# EasyEDA Pro project 嘉立创工程文件.epro

# Board PCB1
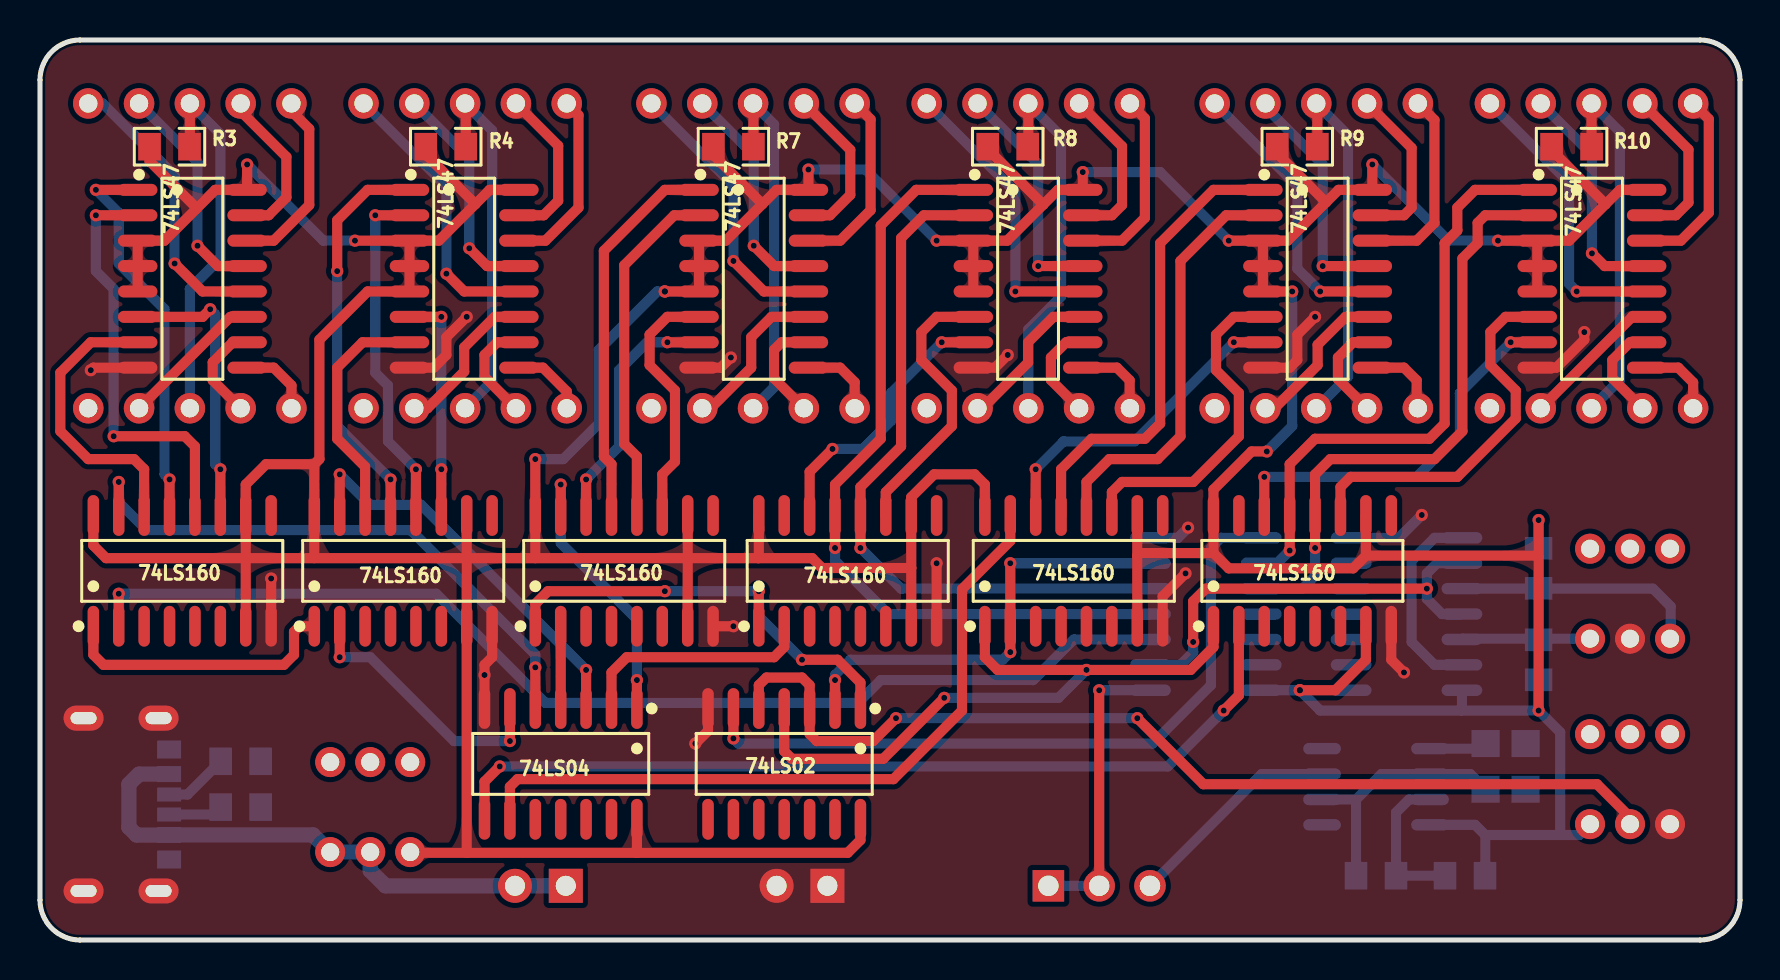
[diagram p0: board, top side]
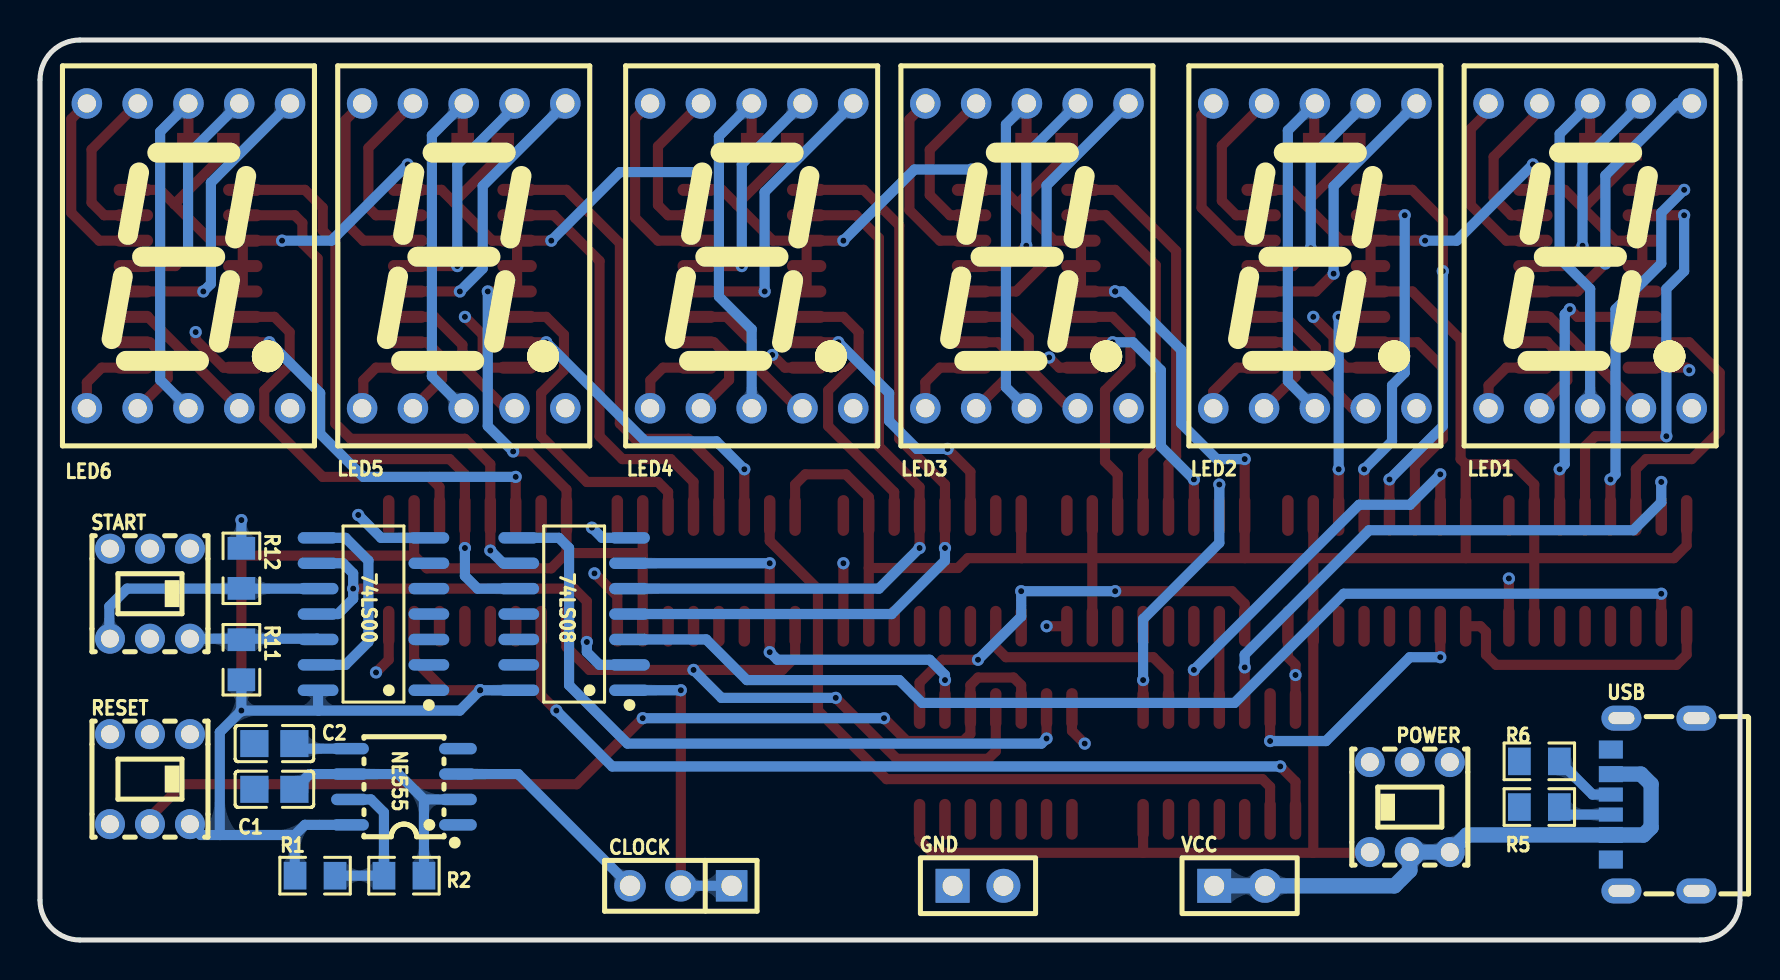
[diagram p1: board, bottom side, seen from below]

Outline 85 x 45 mm; copper layers: Top Layer, Bottom Layer. Coordinates in mm from the lower left corner of the outline.
Outline path: 0,43 0,2 arc(0.59,0.59) 2,0 83,0 arc(84.41,0.59) 85,2 85,43 arc(84.41,44.41) 83,45 2,45 arc(0.59,44.41) 0,43
Stack: Top Layer 0.035mm / Dielectric1 1.51mm FR4 er 4.5 / Bottom Layer 0.035mm

## Design rules (mm)
template: 自定义配置
spacing copperThickness1oz (default): track to track 0.102, other pairs 0.152 to 0.3
spacing copperThickness2oz: track to track 0.203, other pairs 0.152 to 0.3
track width copperThickness1oz (default): min 0.127, default 0.254, max 2.54
track width copperThickness2oz: min 0.203, default 0.254, max 2.54
differential pair differentialPair (default): width min 0.127, default 0.254, max 2.54; gap min 0.152, default 0.152
via viaSize (default): diameter min 0.5, default 0.61, max 10; hole min 0.3, default 0.305, max 6.3
net GND uses copperRegion1

## Placement (name value [footprint] x y rotation side)
74LS00  SN74LS00DR  [SOIC-14_L8.7-W3.9-P1.27-LS6.0-BL]  68.33 16.3 90 bottom
74LS02  SN74LS02DR  [SOIC-14_L8.7-W3.9-P1.27-LS6.0-BL]  37.21 8.81 180 top
74LS04  SN74LS04DR  [SOIC-14_L8.7-W3.9-P1.27-LS6.0-BL]  26.03 8.81 180 top
74LS08  SN74LS08DR  [SOIC-14_L8.7-W3.9-P1.27-LS6.0-BL]  58.29 16.3 90 bottom
74LS47  -  [SOIC-16_L9.9-W3.9-P1.27-LS6.0-BL]  21.21 33.06 270 top
74LS47#2  -  [SOIC-16_L9.9-W3.9-P1.27-LS6.0-BL]  7.62 33.06 270 top
74LS47#3  -  [SOIC-16_L9.9-W3.9-P1.27-LS6.0-BL]  35.69 33.06 270 top
74LS47#4  -  [SOIC-16_L9.9-W3.9-P1.27-LS6.0-BL]  49.4 33.06 270 top
74LS47#5  -  [SOIC-16_L9.9-W3.9-P1.27-LS6.0-BL]  63.88 33.06 270 top
74LS47#6  -  [SOIC-16_L9.9-W3.9-P1.27-LS6.0-BL]  77.6 33.06 270 top
74LS160  -  [SOP-16_L9.9-W3.9-P1.27-LS6.0-BL]  7.11 18.46 0 top
74LS160#2  -  [SOP-16_L9.9-W3.9-P1.27-LS6.0-BL]  18.16 18.46 0 top
74LS160#3  -  [SOP-16_L9.9-W3.9-P1.27-LS6.0-BL]  29.21 18.46 0 top
74LS160#4  -  [SOP-16_L9.9-W3.9-P1.27-LS6.0-BL]  40.39 18.46 0 top
74LS160#5  -  [SOP-16_L9.9-W3.9-P1.27-LS6.0-BL]  51.69 18.46 0 top
74LS160#6  -  [SOP-16_L9.9-W3.9-P1.27-LS6.0-BL]  63.12 18.46 0 top
C1  1uF  [C0805]  73.28 7.53 180 bottom
C2  10nF  [C0805]  73.28 9.82 0 bottom
CLOCK  -  [HDR-TH_3P-P2.54-V-F]  52.96 2.71 0 bottom
GND  -  [HDR-TH_2P-P2.54-V-F]  38.1 2.71 180 bottom
LED1  -  [LED-SEG-TH_10P-L12.6-W19.0-P2.54-S15.24-BL]  7.49 34.21 180 bottom
LED2  -  [LED-SEG-TH_10P-L12.6-W19.0-P2.54-S15.24-BL]  21.26 34.21 180 bottom
LED3  -  [LED-SEG-TH_10P-L12.6-W19.0-P2.54-S15.24-BL]  35.65 34.21 180 bottom
LED4  -  [LED-SEG-TH_10P-L12.6-W19.0-P2.54-S15.24-BL]  49.42 34.21 180 bottom
LED5  -  [LED-SEG-TH_10P-L12.6-W19.0-P2.54-S15.24-BL]  63.81 34.21 180 bottom
LED6  -  [LED-SEG-TH_10P-L12.6-W19.0-P2.54-S15.24-BL]  77.58 34.21 180 bottom
NE555  NE555PSRG4  [SO-8_L4.9-W3.9-P1.27-LS5.9-BL]  66.8 7.66 90 bottom
POWER  XKB5858-Z  [SW-TH_6P-L5.8-W5.8-P2.00-LS4.5-BL]  16.51 6.65 0 bottom
R1  10K  [R0805]  71.25 3.22 180 bottom
R2  2.2K  [R0805]  66.8 3.22 0 bottom
R3  750  [R0805]  6.48 39.67 180 top
R4  750  [R0805]  20.29 39.67 180 top
R5  5.1K  [R0805]  10.03 6.65 0 bottom
R6  5.1K  [R0805]  10.03 8.93 0 bottom
R7  750  [R0805]  34.67 39.67 180 top
R8  750  [R0805]  48.39 39.67 180 top
R9  750  [R0805]  62.87 39.67 180 top
R10  750  [R0805]  76.58 39.67 180 top
R11  10K  [R0805]  74.93 14.01 270 bottom
R12  10K  [R0805]  74.93 18.58 270 bottom
RESET  XKB5858-Z  [SW-TH_6P-L5.8-W5.8-P2.00-LS4.5-BL]  79.5 8.04 180 bottom
START  XKB5858-Z  [SW-TH_6P-L5.8-W5.8-P2.00-LS4.5-BL]  79.5 17.31 180 bottom
USB  -  [USB_ TYPE-C-6P]  4.32 6.65 90 bottom
VCC  -  [HDR-TH_2P-P2.54-V-F]  25.02 2.71 180 bottom

## Footprints (pads in the part's own frame, mm; a bottom-side part is the same pattern mirrored in y, then rotated)
C0805
  rect 1.41x1.35 smd: 1(-1,0) 2(1,0)
HDR-TH_2P-P2.54-V-F
  rect 1.7x1.7 hole 1: 1(-1.27,0)
  round 1.7 hole 1: 2(1.27,0)
HDR-TH_3P-P2.54-V-F
  rect 1.575x1.575 hole 1.02: 1(-2.54,0)
  round 1.575 hole 1.02: 2(0,0) 3(2.54,0)
LED-SEG-TH_10P-L12.6-W19.0-P2.54-S15.24-BL
  round 1.524 hole 0.914: 1(-5.08,-7.62) 2(-2.54,-7.62) 3(0,-7.62) 4(2.54,-7.62) 5(5.08,-7.62) 6(5.08,7.62) 7(2.54,7.62) 8(0,7.62) 9(-2.54,7.62) 10(-5.08,7.62)
R0805
  rect 1.133x1.377 smd: 1(-1,0) 2(1,0)
SO-8_L4.9-W3.9-P1.27-LS5.9-BL
  oval 0.574x1.888 smd: 1(-1.905,-2.699) 2(-0.635,-2.699) 3(0.635,-2.699) 4(1.905,-2.699) 5(1.905,2.699) 6(0.635,2.699) 7(-0.635,2.699) 8(-1.905,2.699)
SOIC-14_L8.7-W3.9-P1.27-LS6.0-BL
  oval 0.574x2.038 smd: 1(-3.81,-2.769) 2(-2.54,-2.769) 3(-1.27,-2.769) 4(0,-2.769) 5(1.27,-2.769) 6(2.54,-2.769) 7(3.81,-2.769) 8(3.81,2.769) 9(2.54,2.769) 10(1.27,2.769) 11(0,2.769) 12(-1.27,2.769) 13(-2.54,2.769) 14(-3.81,2.769)
SOIC-16_L9.9-W3.9-P1.27-LS6.0-BL
  oval 0.602x1.971 smd: 1(-4.445,-2.736) 2(-3.175,-2.736) 3(-1.905,-2.736) 4(-0.635,-2.736) 5(0.635,-2.736) 6(1.905,-2.736) 7(3.175,-2.736) 8(4.445,-2.736) 9(4.445,2.736) 10(3.175,2.736) 11(1.905,2.736) 12(0.635,2.736) 13(-0.635,2.736) 14(-1.905,2.736) 15(-3.175,2.736) 16(-4.445,2.736)
SOP-16_L9.9-W3.9-P1.27-LS6.0-BL
  oval 0.574x2.038 smd: 1(-4.445,-2.769) 2(-3.175,-2.769) 3(-1.905,-2.769) 4(-0.635,-2.769) 5(0.635,-2.769) 6(1.905,-2.769) 7(3.175,-2.769) 8(4.445,-2.769) 9(4.445,2.769) 10(3.175,2.769) 11(1.905,2.769) 12(0.635,2.769) 13(-0.635,2.769) 14(-1.905,2.769) 15(-3.175,2.769) 16(-4.445,2.769)
SW-TH_6P-L5.8-W5.8-P2.00-LS4.5-BL
  round 1.5 hole 0.9: 1(-2,-2.25) 2(0,-2.25) 3(2,-2.25) 4(-2,2.25) 5(0,2.25) 6(2,2.25)
USB_ TYPE-C-6P
  oval 1.25x2 hole 0.6x1.3: 7(-4.193,1.611) 8(4.447,1.611) 9(-4.193,-2.139) 10(4.447,-2.139)
  rect 0.7x1.2 smd: A5(-0.373,2.139) B5(0.627,2.139)
  rect 0.8x1.2 smd: A9(1.647,2.139) B9(-1.393,2.139)
  rect 0.9x1.2 smd: A12(2.877,2.139) B12(-2.623,2.139)

## Nets
GND: 74LS00.7 74LS02.7 74LS04.7 74LS08.7 74LS47.8 74LS47#2.8 74LS47#3.8 74LS47#4.8 74LS47#5.8 74LS47#6.8 74LS160.8 74LS160#2.8 74LS160#3.8 74LS160#4.8 74LS160#5.8 74LS160#6.8 C1.1 C2.2 GND.1 GND.2 NE555.1 NE555.4 R5.2 R6.2 RESET.1 START.2 USB.7 USB.8 USB.9 USB.10 USB.A12 USB.B12
VCC: 74LS00.14 74LS02.14 74LS04.14 74LS08.14 74LS47.3 74LS47.4 74LS47.5 74LS47.16 74LS47#2.3 74LS47#2.4 74LS47#2.5 74LS47#2.16 74LS47#3.3 74LS47#3.4 74LS47#3.5 74LS47#3.16 74LS47#4.3 74LS47#4.4 74LS47#4.5 74LS47#4.16 74LS47#5.3 74LS47#5.4 74LS47#5.5 74LS47#5.16 74LS47#6.3 74LS47#6.4 74LS47#6.5 74LS47#6.16 74LS160.7 74LS160.10 74LS160.16 74LS160#2.7 74LS160#2.10 74LS160#2.16 74LS160#3.7 74LS160#3.10 74LS160#3.16 74LS160#4.7 74LS160#4.10 74LS160#4.16 74LS160#5.7 74LS160#5.10 74LS160#5.16 74LS160#6.7 74LS160#6.10 74LS160#6.16 NE555.8 POWER.6 R1.1 R3.2 R4.2 R7.2 R8.2 R9.2 R10.2 R11.2 R12.1 RESET.3
$1N999: 74LS47#2.13 LED1.7
$1N1001: 74LS47#2.12 LED1.6
$1N1003: 74LS47#2.11 LED1.4
$1N1005: 74LS47#2.10 LED1.2
$1N1007: 74LS47#2.9 LED1.1
$1N1023: 74LS47#2.14 LED1.10
$1N1028: 74LS47#2.15 LED1.9
$1N1089: LED1.3 LED1.8 R3.1
$1N1147: 74LS47#2.1 74LS160.13
$1N1150: 74LS47#2.2 74LS160.12
$1N1153: 74LS47#2.6 74LS160.11
$1N1161: 74LS47#2.7 74LS160.14
$1N1913: NE555.7 R1.2 R2.2
$1N1926: C1.2 NE555.2 NE555.6 R2.1
$1N2122: C2.1 NE555.5
$1N2566: 74LS08.1 CLOCK.1 CLOCK.2
$1N2570: CLOCK.3 NE555.3
$1N2724: 74LS08.3 74LS160.2
$1N3048: 74LS47.11 LED2.4
$1N3050: 74LS47.10 LED2.2
$1N3052: 74LS47.9 LED2.1
$1N3054: 74LS47.12 LED2.6
$1N3056: 74LS47.13 LED2.7
$1N3058: 74LS47.14 LED2.10
$1N3062: 74LS47.15 LED2.9
$1N3066: LED2.3 LED2.8 R4.1
$1N3073: 74LS47.1 74LS160#2.13
$1N3075: 74LS47.2 74LS160#2.12
$1N3077: 74LS47.6 74LS160#2.11
$1N3081: 74LS47.7 74LS160#2.14
$1N3329: 74LS160.1 74LS160#2.1
$1N3374: R5.1 USB.A5
$1N3426: R6.1 USB.B5
$1N3994: 74LS47#3.11 LED3.4
$1N3996: 74LS47#3.10 LED3.2
$1N3998: 74LS47#3.9 LED3.1
$1N4000: 74LS47#3.12 LED3.6
$1N4002: 74LS47#3.13 LED3.7
$1N4004: 74LS47#3.14 LED3.10
$1N4008: 74LS47#3.15 LED3.9
$1N4012: LED3.3 LED3.8 R7.1
$1N4019: 74LS47#3.1 74LS160#3.13
$1N4021: 74LS47#3.2 74LS160#3.12
$1N4023: 74LS47#3.6 74LS160#3.11
$1N4027: 74LS47#3.7 74LS160#3.14
$1N4390: 74LS04.3 74LS160#2.15
$1N4396: 74LS04.4 74LS160#3.2
$1N4713: 74LS47#4.11 LED4.4
$1N4715: 74LS47#4.10 LED4.2
$1N4717: 74LS47#4.9 LED4.1
$1N4719: 74LS47#4.12 LED4.6
$1N4721: 74LS47#4.13 LED4.7
$1N4723: 74LS47#4.14 LED4.10
$1N4727: 74LS47#4.15 LED4.9
$1N4731: LED4.3 LED4.8 R8.1
$1N4742: 74LS47#4.6 74LS160#4.11
$1N4746: 74LS47#4.7 74LS160#4.14
$1N4816: 74LS08.4 74LS47#4.1 74LS160#4.13
$1N4845: 74LS08.5 74LS47#4.2 74LS160#4.12
$1N5159: 74LS02.1 74LS160#3.1 74LS160#4.1
$1N6867: 74LS47#5.11 LED5.4
$1N6869: 74LS47#5.10 LED5.2
$1N6871: 74LS47#5.9 LED5.1
$1N6873: 74LS47#5.12 LED5.6
$1N6875: 74LS47#5.13 LED5.7
$1N6877: 74LS47#5.14 LED5.10
$1N6881: 74LS47#5.15 LED5.9
$1N6885: LED5.3 LED5.8 R9.1
$1N6892: 74LS47#5.1 74LS160#5.13
$1N6894: 74LS47#5.2 74LS160#5.12
$1N6896: 74LS47#5.6 74LS160#5.11
$1N6900: 74LS47#5.7 74LS160#5.14
$1N6917: 74LS47#6.11 LED6.4
$1N6919: 74LS47#6.10 LED6.2
$1N6921: 74LS47#6.9 LED6.1
$1N6923: 74LS47#6.12 LED6.6
$1N6925: 74LS47#6.13 LED6.7
$1N6927: 74LS47#6.14 LED6.10
$1N6931: 74LS47#6.15 LED6.9
$1N6935: LED6.3 LED6.8 R10.1
$1N6942: 74LS47#6.6 74LS160#6.11
$1N6946: 74LS47#6.7 74LS160#6.14
$1N6998: 74LS02.3 74LS02.5 RESET.2
$1N7178: 74LS02.2 74LS08.6 74LS160#5.2
$1N7221: 74LS08.9 74LS47#6.1 74LS160#6.13
$1N7284: 74LS08.10 74LS47#6.2 74LS160#6.12
$1N7463: 74LS04.9 74LS160#5.15
$1N7493: 74LS02.6 74LS08.8
$1N7514: 74LS02.4 74LS160#5.1 74LS160#6.1
$1N7599: 74LS04.8 74LS160#6.2
$1N9167: 74LS04.1 74LS160#3.15
$1N9178: 74LS04.2 74LS160#4.2
$1N9189: 74LS04.5 74LS160.15
$1N9202: 74LS04.6 74LS160#2.2
$1N9229: 74LS00.12 R11.1 START.3
$1N9276: 74LS00.10 R12.2 START.1
$1N9292: 74LS00.9 74LS00.11 74LS08.2
$1N9334: 74LS00.8 74LS00.13
$1N9513: POWER.4 POWER.5 USB.A9 USB.B9 VCC.1 VCC.2

Pads without a net: 74LS00 1 2 3 4 5 6; 74LS02 8 9 10 11 12 13; 74LS04 10 11 12 13; 74LS08 11 12 13; 74LS160 3 4 5 6 9; 74LS160#2 3 4 5 6 9; 74LS160#3 3 4 5 6 9; 74LS160#4 3 4 5 6 9 15; 74LS160#5 3 4 5 6 9; 74LS160#6 3 4 5 6 9 15; LED1 5; LED2 5; LED3 5; LED4 5; LED5 5; LED6 5; POWER 1 2 3; RESET 4 5 6; START 4 5 6

## Via types
v1: diameter 0.61, hole 0.305, Top Layer to Bottom Layer, 109 vias

## Routing (per net, layer and track width the routed paths; a pad name or vN(x,y) marks a point on that pad's centre or on a via; arc(x,y) is an arc through that point)
GND: length 43
  Top Layer w0.508: 74LS47#5.8 62.48,28.62 62.87,29 62.87,30.27 v1(63.75,31.16) ; v1(68.2,13.38) 67.56,14.01 74LS160#6.8 ; v1(32.77,9.82) 33.4,10.46 74LS02.7 ; v1(77.22,30.39) 77.22,30.01 75.82,28.62 74LS47#6.8 ; 74LS47#3.8 34.04,28.62 v1(34.54,29.12) ; v1(2.54,28.49) 2.67,28.62 74LS47#2.8 ; v1(21.34,31.16) 20.32,30.14 20.32,29.25 19.69,28.62 74LS47.8 ; 74LS160#5.8 56.13,17.19 v1(57.28,18.33) ; v1(48.39,29.25) 47.75,28.62 74LS47#4.8 ; 74LS160#4.8 v1(44.83,18.84) ; 74LS160#3.8 v1(34.67,15.69) ; 74LS160.8 v1(11.56,18.08) ; 74LS160#2.8 22.61,14.14 22.22,13.76 v1(22.22,13.25) 74LS04.7
  Bottom Layer w0.508: v1(69.09,21.25) 67.94,20.11 74LS00.7 ; 74LS08.7 56.9,20.11 v1(57.4,20.62)
VCC: length 369.1
  Top Layer w0.508: 74LS160#5.16 47.24,22.78 46.74,23.28 44.7,23.28 43.56,22.14 74LS160#4.10 43.56,18.6 ; v1(62.99,12.49) 64.77,12.49 66.29,14.01 74LS160#6.7 ; v1(62.61,32.43) 61.15,32.43 74LS47#5.4 74LS47#5.3 ; 10.29,19.09 21.34,19.09 ; 10.29,19.09 10.29,15.69 ; 10.29,19.09 10.29,22.78 11.3,23.79 13.72,23.79 ; 10.29,19.09 3.3,19.09 2.67,19.73 74LS160.16 ; 21.34,19.09 74LS160#2.7 21.34,4.38 21.35,4.36 ; 21.34,19.09 32.38,19.09 ; 21.34,19.09 74LS160#2.10 ; 21.35,4.36 18.55,4.36 POWER.6 ; 21.35,4.36 29.84,4.36 ; R7.2 33.67,39.25 36.12,36.8 ; 74LS47.16 22.48,37.51 21.77,36.8 ; 4.88,32.43 74LS47#2.4 74LS47#2.3 6.22,34.97 7.8,36.55 ; 43.56,18.6 39.1,18.6 38.61,19.09 35.92,19.09 ; 43.56,18.6 74LS160#4.7 ; 54.86,19.21 74LS160#5.7 ; 54.86,19.21 55,19.35 58.67,19.35 ; 54.86,19.21 74LS160#5.10 ; v1(66.62,38.78) 74LS47#5.16 64.93,37.51 64.3,36.89 ; 24.76,19.09 v1(24.76,24.05) ; 58.67,19.35 74LS160#6.16 58.67,22.52 60.58,24.43 v1(61.34,24.43) ; 58.67,19.35 59.44,18.58 65.66,18.58 66.29,19.22 ; 21.77,36.8 19.29,39.28 R4.2 ; 21.77,36.8 19.94,34.97 74LS47.3 ; 74.93,19.16 v1(74.93,21) ; 74.93,19.16 v1(74.93,11.47) ; 74.93,19.16 74.87,19.22 66.29,19.22 ; 66.29,19.22 74LS160#6.10 ; 13.72,23.79 13.97,24.05 13.97,30.01 16.38,32.43 18.47,32.43 74LS47.4 74LS47.3 ; 13.72,23.79 74LS160#2.16 13.72,19.09 ; v1(31.24,32.43) 32.95,32.43 74LS47#3.4 74LS47#3.3 34.29,34.97 36.12,36.8 ; 32.38,19.09 32.38,15.69 ; 32.38,19.09 35.92,19.09 ; 32.38,19.09 32.38,21.23 ; 46.67,32.43 74LS47#4.4 74LS47#4.3 ; 36.12,36.8 36.83,37.51 74LS47#3.16 v1(38.42,38.52) ; R9.2 61.87,39.32 64.3,36.89 ; 74LS47#6.3 74LS47#6.4 74.86,32.43 ; 74LS47#6.3 v1(72.9,34.97) ; 74LS47#6.3 76.45,34.97 78.28,36.79 ; R10.2 75.58,39.49 78.28,36.79 ; 35.92,19.09 35.94,19.11 74LS160#4.16 ; 50.16,36.77 48.36,34.97 74LS47#4.3 ; 50.16,36.77 47.39,39.54 R8.2 ; 50.16,36.77 50.9,37.51 74LS47#4.16 v1(52.14,38.4) ; 7.8,36.55 8.76,37.51 74LS47#2.16 v1(10.36,38.78) ; 7.8,36.55 7.8,36.62 5.48,38.95 R3.2 ; 64.3,36.89 62.38,34.97 74LS47#5.3 ; 74LS04.14 29.84,4.36 ; 29.84,4.36 40.39,4.36 41.02,5 41.02,6.04 ; 74LS47#4.3 v1(44.83,34.97) ; 74LS47#5.3 v1(59.44,34.97) ; 74LS47.3 v1(15.75,34.97) ; 78.28,36.79 78.99,37.51 74LS47#6.16
  Bottom Layer w0.508: 76.01,5.25 72.26,5.25 ; 76.01,5.25 76.01,10.39 v1(74.93,11.47) ; 76.01,5.25 76.96,5.25 RESET.3 ; 72.26,5.25 71.75,5.76 NE555.8 ; 72.26,5.25 72.26,3.23 R1.1 ; v1(24.76,24.05) 26.16,24.05 27.94,25.82 27.94,29.51 30.86,32.43 v1(31.24,32.43) ; v1(74.93,11.47) R11.2 ; v1(74.93,11.47) 71.07,11.47 ; v1(72.9,34.97) 70.43,34.97 v1(66.62,38.78) ; 74LS08.14 v1(62.99,12.49) 64.01,11.47 71.07,11.47 ; v1(62.61,32.43) 62.61,25.7 v1(61.34,24.43) ; 71.07,11.47 71.09,11.5 74LS00.14 ; v1(59.44,34.97) 56.01,38.4 v1(52.14,38.4) ; v1(15.75,34.97) 14.17,34.97 v1(10.36,38.78) ; v1(38.42,38.52) 41.28,38.52 v1(44.83,34.97) ; R12.1 v1(74.93,21)
$1N999: length 11.2
  Top Layer w0.508: 74LS47#2.13 8.89,33.7 v1(7.87,34.71)
  Bottom Layer w0.508: LED1.7 7.87,38.91 v1(7.87,34.71)
$1N1001: length 14.4
  Top Layer w0.508: v1(6.73,33.82) 8.13,32.43 10.36,32.43
  Bottom Layer w0.508: LED1.6 3.13,41.83 6.73,38.23 v1(6.73,33.82)
$1N1003: length 7.3
  Top Layer w0.508: LED1.4 9.52,31.16 74LS47#2.11
$1N1005: length 5
  Top Layer w0.508: LED1.2 8.64,27.98 8.64,28.89 9.64,29.89 74LS47#2.10
$1N1007: length 3.7
  Top Layer w0.508: 74LS47#2.9 11.68,28.62 12.57,27.73 LED1.1
$1N1023: length 9.3
  Top Layer w0.508: 74LS47#2.14 11.68,34.97 13.46,36.75 13.46,40.56 12.57,41.44 LED1.10
$1N1028: length 8
  Top Layer w0.508: 74LS47#2.15 11.43,36.24 12.32,37.13 12.32,39.16 10.03,41.44 LED1.9
$1N1089: length 18.7
  Top Layer w0.508: LED1.8 7.49,39.68 R3.1
  Bottom Layer w0.508: LED1.8 9.02,40.3 9.02,34.08 7.49,32.55 LED1.3
$1N1147: length 19.9
  Top Layer w0.508: 74LS47#2.1 v1(2.79,37.51) ; v1(6.48,23.03) 74LS160.13
  Bottom Layer w0.508: v1(2.79,37.51) 3.94,36.36 3.94,33.82 6.22,31.54 6.22,23.28 v1(6.48,23.03)
$1N1150: length 21.2
  Top Layer w0.508: v1(3.68,25.19) 7.24,25.19 7.75,24.68 74LS160.12 ; 74LS47#2.2 v1(2.79,36.24)
  Bottom Layer w0.508: v1(2.79,36.24) 2.79,33.44 3.68,32.55 v1(3.68,25.19)
$1N1153: length 14.3
  Top Layer w0.508: v1(8.51,31.54) 8.13,31.16 74LS47#2.6 ; v1(9.02,23.54) 74LS160.11
  Bottom Layer w0.508: v1(9.02,23.54) 8.76,23.79 8.76,31.28 v1(8.51,31.54)
$1N1161: length 14.7
  Top Layer w0.508: 74LS160.14 5.21,23.54 4.7,24.05 2.41,24.05 1.02,25.44 1.02,28.36 2.54,29.89 74LS47#2.7
$1N1913: length 7.6
  Bottom Layer w0.508: R1.2 R2.2 67.8,6.38 68.45,7.03 NE555.7
$1N1926: length 12.8
  Bottom Layer w0.508: 65.8,7.03 R2.1 ; 65.8,7.03 64.1,7.03 ; 65.8,7.03 67.07,8.3 71.52,8.3 C1.2
$1N2122: length 2.9
  Bottom Layer w0.508: NE555.5 72.03,9.57 C2.1
$1N2566: length 14.9
  Top Layer w0.508: v1(52.96,2.71) v1(52.96,12.49)
  Bottom Layer w0.508: CLOCK.1 v1(52.96,2.71) ; v1(52.96,12.49) 74LS08.1
$1N2570: length 10.9
  Bottom Layer w0.508: 64.1,8.3 61.09,8.3 CLOCK.3
$1N2724: length 56.8
  Top Layer w0.508: v1(3.94,17.31) 74LS160.2
  Bottom Layer w0.508: v1(3.94,17.31) 19.81,17.31 25.27,11.85 40.89,11.85 42.04,13 49.66,13 51.69,15.03 74LS08.3
$1N3048: length 7.8
  Top Layer w0.508: LED2.4 19.38,26.59 21.21,28.42 21.21,29.63 22.73,31.16 74LS47.11
$1N3050: length 5.3
  Top Layer w0.508: 74LS47.10 22.86,29.89 22.22,29.25 22.22,28.16 LED2.2
$1N3052: length 3.7
  Top Layer w0.508: 74LS47.9 25.15,28.62 26.34,27.43 LED2.1
$1N3054: length 14.2
  Top Layer w0.508: v1(20.32,33.32) 21.21,32.43 23.94,32.43
  Bottom Layer w0.508: v1(20.32,33.32) 20.32,37.68 v1(16.18,41.83)
$1N3056: length 11.2
  Top Layer w0.508: 74LS47.13 22.35,33.7 v1(21.46,34.59)
  Bottom Layer w0.508: v1(18.72,41.83) 21.46,39.08 v1(21.46,34.59)
$1N3058: length 9.1
  Top Layer w0.508: LED2.10 26.92,41.24 26.92,36.62 25.27,34.97 74LS47.14
$1N3062: length 8
  Top Layer w0.508: LED2.9 25.91,39.72 25.91,36.96 25.18,36.24 74LS47.15
$1N3066: length 18.5
  Top Layer w0.508: R4.1 21.29,41.8 v1(21.26,41.83)
  Bottom Layer w0.508: v1(21.26,41.83) 22.61,40.48 22.61,27.94 LED2.3
$1N3073: length 20.1
  Top Layer w0.508: v1(14.86,33.44) 14.86,35.98 16.38,37.51 74LS47.1 ; 74LS160#2.13 v1(17.53,23.03)
  Bottom Layer w0.508: v1(14.86,33.44) 14.86,25.7 v1(17.53,23.03)
$1N3075: length 17.6
  Top Layer w0.508: 74LS47.2 v1(16.76,36.24) ; v1(18.8,23.54) 74LS160#2.12
  Bottom Layer w0.508: v1(18.8,23.54) 17.4,24.93 17.4,27.73 16.76,28.36 v1(16.76,36.24)
$1N3077: length 11.5
  Top Layer w0.508: v1(20.07,31.16) 74LS47.6 ; 74LS160#2.11 v1(20.07,23.54)
  Bottom Layer w0.508: v1(20.07,31.16) v1(20.07,23.54)
$1N3081: length 12.1
  Top Layer w0.508: 74LS47.7 16.13,29.89 14.86,28.62 14.86,25.06 16.26,23.66 74LS160#2.14
$1N3329: length 14.2
  Top Layer w0.508: 74LS160.1 2.67,14.27 3.17,13.76 12.19,13.76 12.7,14.27 12.7,15.41 12.98,15.69 74LS160#2.1
$1N3374: length 2.7
  Bottom Layer w0.508: R5.1 8.66,6.27 USB.A5
$1N3426: length 3.3
  Bottom Layer w0.508: R6.1 7.37,7.27 USB.B5
$1N3994: length 8.1
  Top Layer w0.508: LED3.4 33.53,26.59 35.56,28.62 35.56,30.14 36.58,31.16 74LS47#3.11
$1N3996: length 5.4
  Top Layer w0.508: LED3.2 36.7,28.08 36.7,29.51 37.08,29.89 74LS47#3.10
$1N3998: length 3.9
  Top Layer w0.508: 74LS47#3.9 40,28.62 40.73,27.89 v1(40.73,26.59)
$1N4000: length 14
  Top Layer w0.508: 38.42,32.43 36.19,32.43 v1(34.67,33.95)
  Bottom Layer w0.508: v1(34.67,33.95) 34.67,37.73 v1(30.57,41.83)
$1N4002: length 11.3
  Top Layer w0.508: 74LS47#3.13 36.7,33.7 v1(35.69,34.71)
  Bottom Layer w0.508: v1(33.11,41.83) 35.69,39.25 v1(35.69,34.71)
$1N4004: length 9.4
  Top Layer w0.508: LED3.10 41.53,41.03 41.53,36.49 40,34.97 74LS47#3.14
$1N4008: length 8
  Top Layer w0.508: LED3.9 40.51,39.51 40.51,37.25 39.5,36.24 74LS47#3.15
$1N4012: length 18.3
  Top Layer w0.508: v1(35.65,41.83) 35.67,41.81 R7.1
  Bottom Layer w0.508: LED3.3 36.7,27.64 36.7,40.78 v1(35.65,41.83)
$1N4019: length 19.4
  Top Layer w0.508: 74LS160#3.13 28.57,23.79 28.19,24.17 28.19,34.46 31.24,37.51 74LS47#3.1
$1N4021: length 17.5
  Top Layer w0.508: 74LS160#3.12 29.84,24.17 29.21,24.81 29.21,33.73 31.71,36.24 74LS47#3.2
$1N4023: length 12.7
  Top Layer w0.508: 74LS47#3.6 31.37,31.16 30.48,30.27 30.48,28.74 31.75,27.47 31.75,23.92 31.12,23.28 74LS160#3.11
$1N4027: length 12.5
  Top Layer w0.508: v1(31.37,29.89) 74LS47#3.7 ; v1(27.31,23.03) 74LS160#3.14
  Bottom Layer w0.508: v1(31.37,29.89) 30.35,29.89 28.96,28.49 28.96,24.68 v1(27.31,23.03)
$1N4390: length 20.4
  Top Layer w0.508: v1(14.99,23.28) 74LS160#2.15 ; 74LS04.3 v1(27.31,13.5)
  Bottom Layer w0.508: v1(27.31,13.5) 19.05,21.76 16.51,21.76 v1(14.99,23.28)
$1N4396: length 4.1
  Top Layer w0.508: 74LS04.4 74LS160#3.2
$1N4713: length 7.7
  Top Layer w0.508: LED4.4 47.12,26.59 49.4,28.87 49.4,29.89 50.67,31.16 74LS47#4.11
$1N4715: length 5
  Top Layer w0.508: LED4.2 50.55,28 50.55,29.12 51.31,29.89 74LS47#4.10
$1N4717: length 4
  Top Layer w0.508: 74LS47#4.9 53.85,28.62 54.48,27.98 54.48,26.6 LED4.1
$1N4719: length 14.6
  Top Layer w0.508: v1(48.77,32.43) 52.14,32.43
  Bottom Layer w0.508: v1(44.34,41.83) 48.77,37.4 v1(48.77,32.43)
$1N4721: length 11.6
  Top Layer w0.508: v1(49.91,33.7) 74LS47#4.13
  Bottom Layer w0.508: v1(49.91,33.7) 49.91,38.79 v1(46.88,41.83)
$1N4723: length 9.6
  Top Layer w0.508: LED4.10 55.25,41.08 55.25,36.11 54.1,34.97 74LS47#4.14
$1N4727: length 8.1
  Top Layer w0.508: 74LS47#4.15 53.59,36.24 54.1,36.75 54.1,39.68 LED4.9
$1N4731: length 18.8
  Top Layer w0.508: LED4.8 49.42,39.7 R8.1
  Bottom Layer w0.508: LED4.8 51.05,40.19 51.05,32.17 49.42,30.54 v1(49.42,26.59)
$1N4742: length 14.1
  Top Layer w0.508: 74LS160#4.11 42.29,22.39 45.59,25.7 45.59,27.47 44.07,29 44.07,30.39 44.83,31.16 74LS47#4.6
$1N4746: length 13.9
  Top Layer w0.508: v1(39.62,24.55) 38.48,23.41 74LS160#4.14 ; v1(45.09,29.89) 74LS47#4.7
  Bottom Layer w0.508: v1(45.09,29.89) 42.54,27.35 42.54,25.95 41.15,24.55 v1(39.62,24.55)
$1N4816: length 40
  Top Layer w0.508: 74LS47#4.1 43.81,37.51 42.04,35.73 42.04,25.06 39.75,22.78 74LS160#4.13 v1(39.75,19.6)
  Bottom Layer w0.508: 74LS08.4 42.42,16.3 39.75,18.97 v1(39.75,19.6)
$1N4845: length 35.8
  Top Layer w0.508: 74LS47#4.2 44.2,36.24 43.05,35.09 43.05,24.68 41.02,22.65 74LS160#4.12 v1(41.02,19.6)
  Bottom Layer w0.508: 74LS08.5 43.05,17.57 v1(41.02,19.6)
$1N5159: length 23.3
  Top Layer w0.508: v1(38.1,14.01) 39.88,14.01 41.02,12.87 41.02,11.57 ; v1(31.24,17.44) 25.4,17.44 24.76,16.81 24.76,15.69 ; v1(35.94,17.44) 74LS160#4.1
  Bottom Layer w0.508: v1(38.1,14.01) 35.94,16.17 v1(35.94,17.44) v1(31.24,17.44)
$1N6867: length 7.8
  Top Layer w0.508: 74LS47#5.11 65.28,31.16 63.88,29.76 63.88,28.74 61.72,26.59 v1(61.27,26.59)
$1N6869: length 5.2
  Top Layer w0.508: 74LS47#5.10 65.66,29.89 64.9,29.12 64.9,28.04 LED5.2
$1N6871: length 3.9
  Top Layer w0.508: 74LS47#5.9 68.2,28.62 68.83,27.98 68.83,26.65 LED5.1
$1N6873: length 14.2
  Top Layer w0.508: v1(64.01,32.43) 66.62,32.43
  Bottom Layer w0.508: v1(64.01,32.43) 62.87,33.57 62.87,37.7 LED5.6
$1N6875: length 11.8
  Top Layer w0.508: v1(64.13,33.7) 74LS47#5.13
  Bottom Layer w0.508: LED5.7 61.27,41.64 64.13,38.78 v1(64.13,33.7)
$1N6877: length 9.8
  Top Layer w0.508: 74LS47#5.14 68.83,34.97 69.72,35.86 69.72,41 LED5.10
$1N6881: length 8.3
  Top Layer w0.508: 74LS47#5.15 68.2,36.24 68.58,36.62 68.58,39.6 LED5.9
$1N6885: length 18.7
  Top Layer w0.508: v1(63.81,41.83) 63.87,41.78 R9.1
  Bottom Layer w0.508: LED5.3 65.41,28.18 65.41,40.24 v1(63.81,41.83)
$1N6892: length 23.5
  Top Layer w0.508: 74LS47#5.1 58.67,37.51 56.01,34.84 56.01,25.82 55.25,25.06 52.58,25.06 51.05,23.54 74LS160#5.13
$1N6894: length 21.2
  Top Layer w0.508: 74LS160#5.12 52.32,22.9 53.47,24.05 55.88,24.05 57.02,25.19 57.02,33.95 59.31,36.24 74LS47#5.2
$1N6896: length 16.9
  Top Layer w0.508: 74LS160#5.11 53.59,22.39 54.1,22.9 57.66,22.9 59.94,25.19 59.94,27.35 58.8,28.49 58.8,30.27 59.69,31.16 74LS47#5.6
$1N6900: length 16.3
  Top Layer w0.508: 74LS47#5.7 v1(59.69,29.89) ; v1(49.78,23.54) 74LS160#5.14
  Bottom Layer w0.508: v1(49.78,23.54) 51.18,24.93 54.74,24.93 v1(59.69,29.89)
$1N6917: length 7.2
  Top Layer w0.508: 74LS47#6.11 79.61,31.16 LED6.4
$1N6919: length 5.1
  Top Layer w0.508: LED6.2 78.61,28.09 78.61,29 79.5,29.89 74LS47#6.10
$1N6921: length 3.9
  Top Layer w0.508: 74LS47#6.9 81.91,28.62 82.66,27.88 LED6.1
$1N6923: length 14.7
  Top Layer w0.508: v1(76.84,32.43) 80.33,32.43
  Bottom Layer w0.508: v1(76.84,32.43) 76.45,32.81 76.45,37.87 v1(72.5,41.83)
$1N6925: length 11.6
  Top Layer w0.508: v1(77.6,34.33) 78.23,33.7 74LS47#6.13
  Bottom Layer w0.508: LED6.7 77.6,39.27 v1(77.6,34.33)
$1N6927: length 9.5
  Top Layer w0.508: 74LS47#6.14 82.04,34.97 83.44,36.36 83.44,41.05 LED6.10
$1N6931: length 8.3
  Top Layer w0.508: 74LS47#6.15 81.79,36.24 82.42,36.87 82.42,39.52 LED6.9
$1N6935: length 18.6
  Top Layer w0.508: v1(77.58,41.83) 77.58,39.67 R10.1
  Bottom Layer w0.508: v1(77.58,41.83) 78.99,40.41 78.99,28 v1(77.58,26.59)
$1N6942: length 19.1
  Top Layer w0.508: 74LS47#6.6 73.28,31.16 72.52,30.39 72.52,28.74 73.79,27.47 73.79,26.08 70.87,23.16 65.53,23.16 65.02,22.65 74LS160#6.11
$1N6946: length 19.6
  Top Layer w0.508: 74LS160#6.14 v1(61.21,23.16) ; v1(73.53,29.89) 74LS47#6.7
  Bottom Layer w0.508: v1(73.53,29.89) 70.99,27.35 70.99,25.31 68.83,23.16 v1(61.21,23.16)
$1N6998: length 50.5
  Top Layer w0.508: RESET.2 79.5,6.14 77.85,7.79 58.17,7.79 v1(54.86,11.09) ; v1(42.8,11.09) 41.66,9.95 38.83,9.95 38.48,10.3 38.48,12.74 38.1,13.12 36.32,13.12 35.94,12.74 74LS02.5
  Bottom Layer w0.508: v1(42.8,11.09) v1(54.86,11.09)
$1N7178: length 22.4
  Top Layer w0.508: v1(48.51,18.84) 74LS160#5.2 v1(48.51,14.39) ; v1(39.75,13) 74LS02.2
  Bottom Layer w0.508: v1(39.75,13) 39.75,13.25 40.51,14.01 48.13,14.01 v1(48.51,14.39) ; v1(48.51,18.84) 74LS08.6
$1N7221: length 30
  Top Layer w0.508: 74LS47#6.1 71.75,37.51 70.87,36.62 70.87,35.47 70.23,34.84 70.23,25.82 69.47,25.06 63.75,25.06 62.48,23.79 74LS160#6.13 v1(62.48,19.47)
  Bottom Layer w0.508: v1(62.48,19.47) 61.85,18.84 74LS08.9
$1N7284: length 30.2
  Top Layer w0.508: v1(63.75,19.6) 74LS160#6.12 63.75,23.28 64.52,24.05 69.72,24.05 71.12,25.44 71.12,34.08 71.88,34.84 71.88,35.86 72.26,36.24 74LS47#6.2
  Bottom Layer w0.508: 74LS08.10 63.12,17.57 63.75,18.2 v1(63.75,19.6)
$1N7463: length 36.6
  Top Layer w0.508: 74LS160#5.15 48.51,19.95 46.1,17.54 46.1,11.47 42.67,8.04 23.88,8.04 23.5,7.66 74LS04.9
$1N7493: length 36.3
  Top Layer w0.508: 74LS02.6 v1(34.67,10.08)
  Bottom Layer w0.508: 74LS08.8 59.06,20.11 58.55,19.6 58.55,12.74 55.63,9.82 34.93,9.82 v1(34.67,10.08)
$1N7514: length 34
  Top Layer w0.508: v1(45.21,12.11) 42.16,9.06 37.59,9.06 37.21,9.44 74LS02.4 ; 74LS160#6.1 58.67,14.65 57.53,13.5 v1(52.32,13.5) 47.88,13.5 47.24,14.14 74LS160#5.1
  Bottom Layer w0.508: v1(45.21,12.11) 50.93,12.11 v1(52.32,13.5)
$1N7599: length 44.8
  Top Layer w0.508: v1(59.18,11.47) 59.94,12.23 74LS160#6.2 ; 74LS04.8 22.22,7.92 v1(22.99,8.68)
  Bottom Layer w0.508: v1(59.18,11.47) 56.39,8.68 v1(22.99,8.68)
$1N9167: length 14.3
  Top Layer w0.508: 74LS04.1 v1(29.84,13) ; 74LS160#3.15 v1(26.03,22.78)
  Bottom Layer w0.508: v1(26.03,22.78) 26.03,19.85 29.84,16.04 v1(29.84,13)
$1N9178: length 12
  Top Layer w0.508: 74LS04.2 28.57,13.38 29.34,14.14 36.7,14.14 37.21,14.65 37.21,15.69
$1N9189: length 29.4
  Top Layer w0.508: v1(24.76,13.63) 74LS04.5 ; v1(3.94,22.9) 74LS160.15
  Bottom Layer w0.508: v1(3.94,22.9) 3.94,21.89 5.33,20.49 18.54,20.49 24.76,14.27 v1(24.76,13.63)
$1N9202: length 13.4
  Top Layer w0.508: 74LS160#2.2 v1(14.99,14.14) ; 74LS04.6 v1(23.5,9.95)
  Bottom Layer w0.508: v1(14.99,14.14) 16.51,14.14 20.7,9.95 v1(23.5,9.95)
$1N9229: length 6.4
  Bottom Layer w0.508: 74LS00.12 71.13,15.06 START.3
$1N9276: length 12.4
  Bottom Layer w0.508: 74LS00.10 80.65,17.57 81.53,16.68 81.53,15.1 START.1
$1N9292: length 22.2
  Top Layer w0.508: v1(57.66,14.9) 57.66,16.93 58.29,17.57 v1(69.34,17.57)
  Bottom Layer w0.508: 74LS00.11 70.1,16.3 69.34,17.06 v1(69.34,17.57) 69.34,18.33 69.85,18.84 74LS00.9 ; v1(57.66,14.9) 57.66,14.39 57.02,13.76 74LS08.2
$1N9334: length 10
  Bottom Layer w0.508: 74LS00.8 69.72,20.11 68.58,18.97 68.58,14.9 69.72,13.76 74LS00.13
$1N9513: length 28
  Bottom Layer w0.762: USB.A9 4.95,8.29 4.44,7.79 4.44,5.63 4.83,5.25 6.45,5.25 USB.B9 13.65,5.25 POWER.4 POWER.5 16.51,3.47 17.27,2.71 VCC.2 26.29,2.71

## Copper pours and planes (outline as drawn; the poured copper is in the pictures)
GND on Top Layer: -1.91,46.65 86.49,46.65 86.49,-1.61 -1.91,-1.61
GND on Bottom Layer: -1.4,45.81 86.23,45.81 86.23,-1.48 -1.4,-1.48

Small or netless copper shapes (teardrops, artwork), in the pictures only: 280 on Top Layer, 91 on Bottom Layer
